# EasyEDA Pro project ProPrj_stm32电赛单片机开发板_2025-02-17.epro, board PCB1
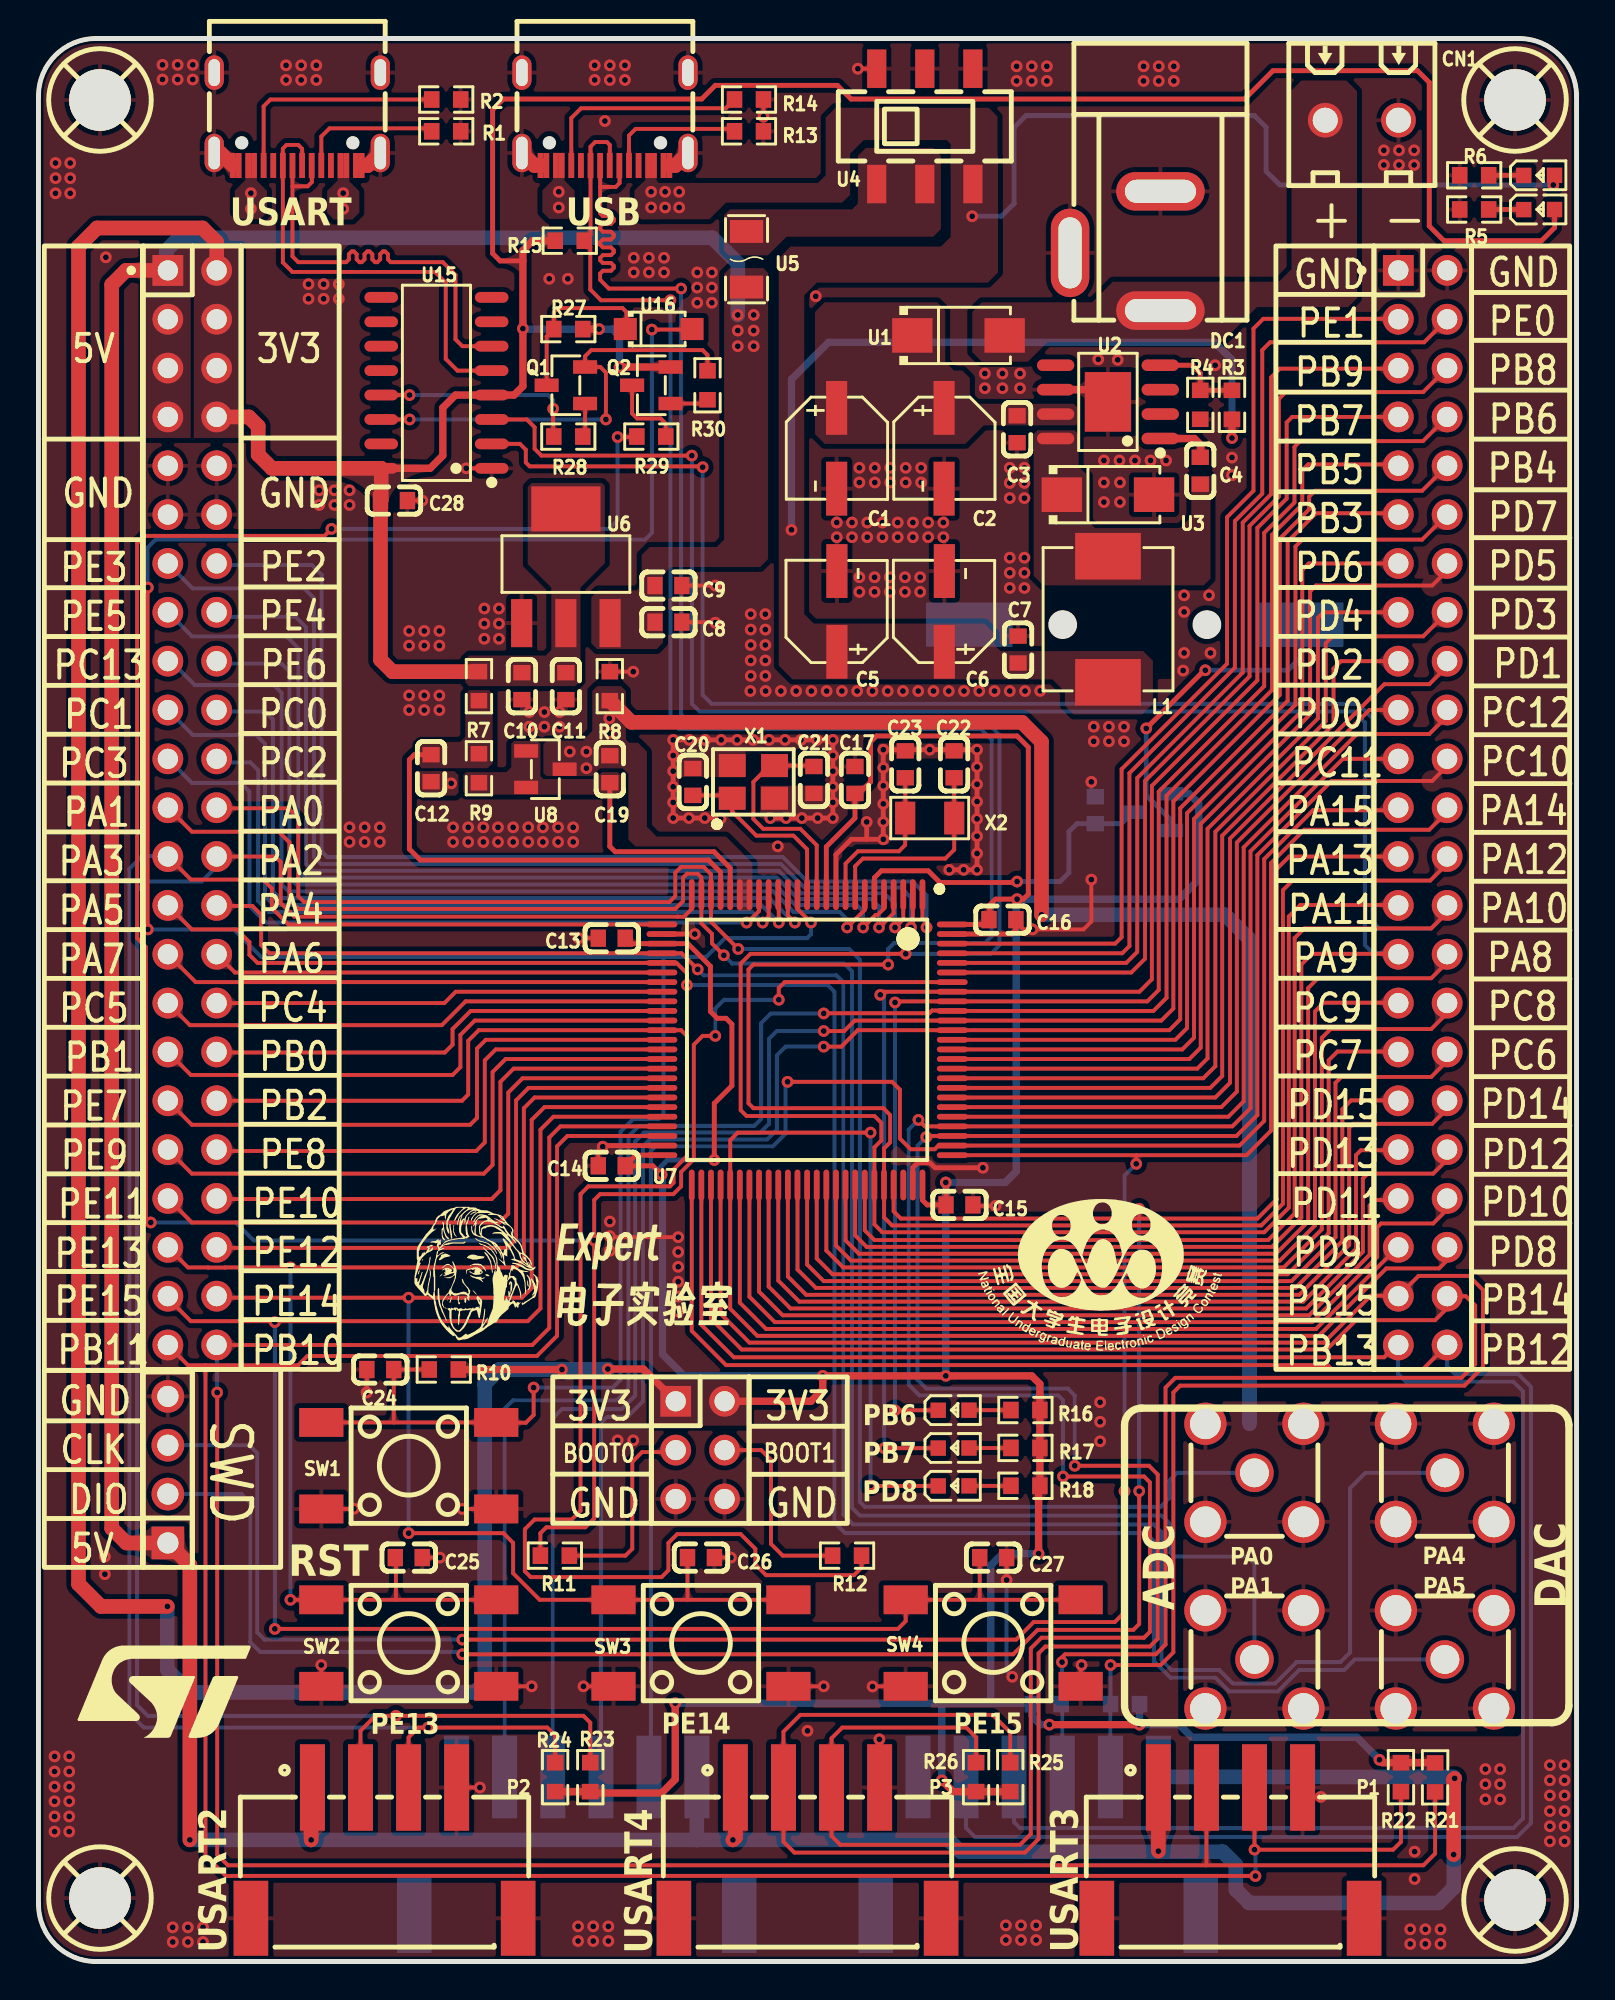
[diagram p3: board, top side]
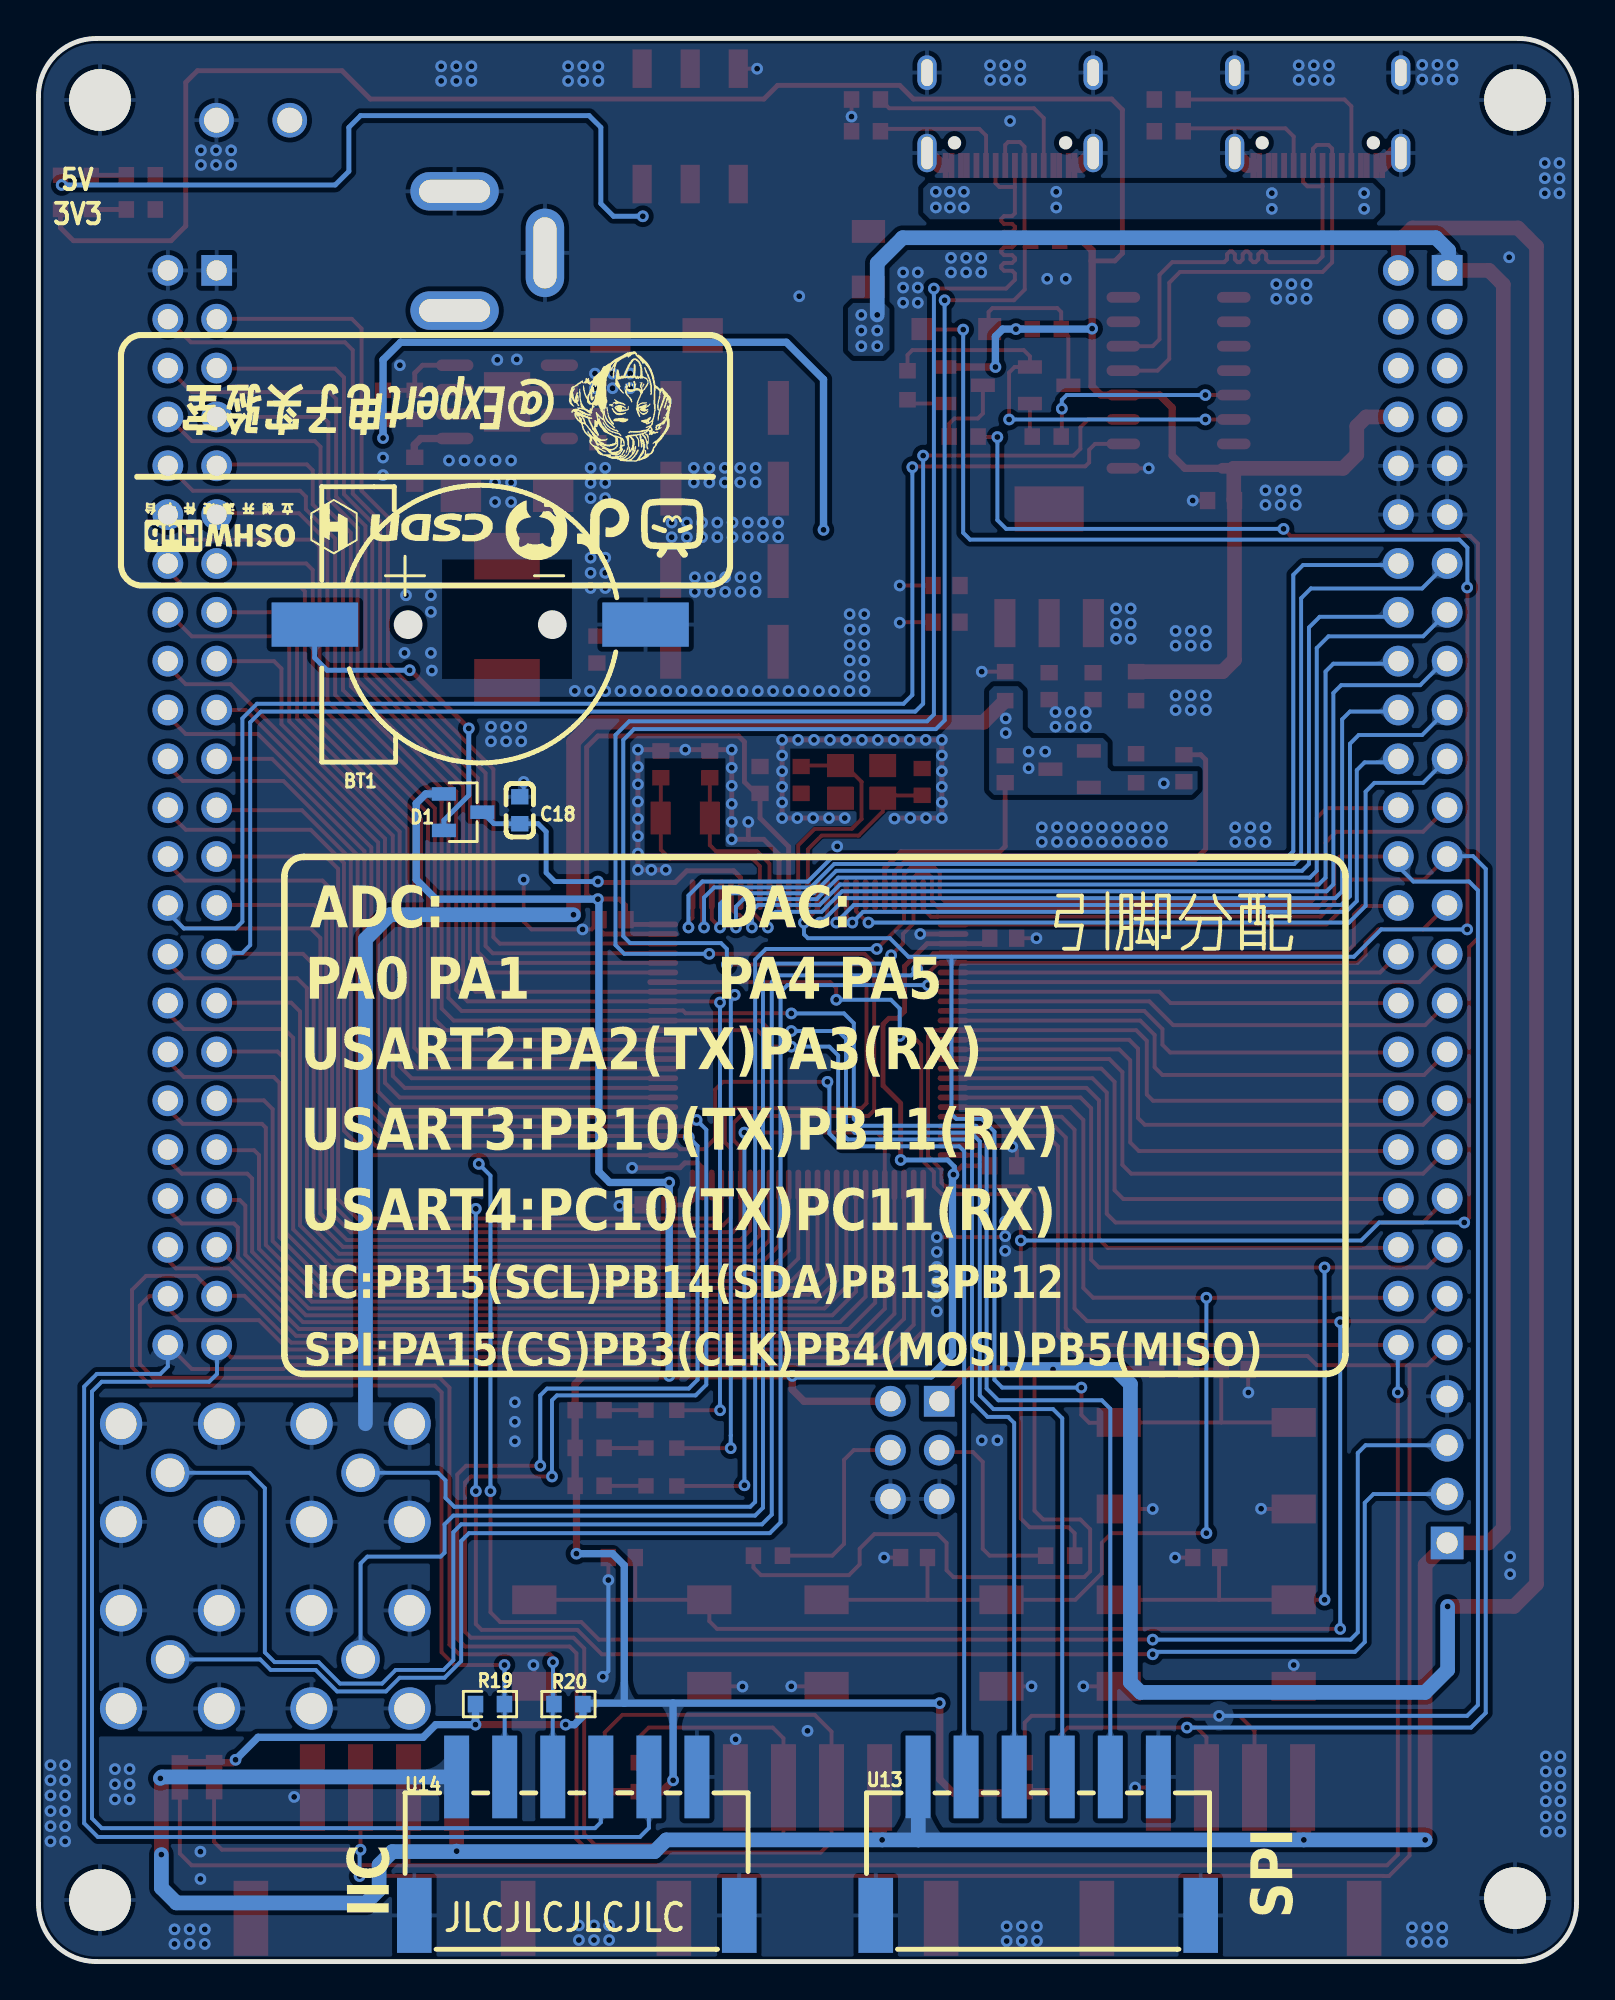
[diagram p4: board, bottom side, seen from below]

Outline 80 x 100 mm; copper layers: Top Layer, Bottom Layer. Coordinates in mm from the lower left corner of the outline.
Outline path: 0,97 0,3 arc(0.88,0.88) 3,0 77,0 arc(79.12,0.88) 80,3 80,97 arc(79.12,99.12) 77,100 3,100 arc(0.88,99.12) 0,97
Stack: Top Layer 0.035mm / Dielectric1 1.51mm FR4 er 4.5 / Bottom Layer 0.035mm

## Design rules (mm)
net PA12: DP2
net PA11: DP2
net DP: DP1
net DN: DP1
template: 自定义配置
spacing copperThickness1oz (default): track to track 0.102, other pairs 0.152 to 0.3
spacing copperThickness2oz: track to track 0.203, other pairs 0.152 to 0.3
track width copperThickness1oz (default): min 0.127, default 0.203, max 2.54
track width copperThickness2oz: min 0.203, default 0.254, max 2.54
differential pair differentialPair (default): width min 0.127, default 0.203, max 2.54; gap min 0.102, default 0.102
via viaSize (default): diameter min 0.5, default 0.61, max 10; hole min 0.3, default 0.305, max 6.299

## Placement (name value [footprint] x y rotation side)
BT1  CR1220-2ZX  [BAT-SMD_CR1220-2ZX]  57.02 69.52 180 bottom
C1  4.7uF  [CAP-SMD_BD5.0-L5.3-W5.3-FD]  41.52 78.69 270 top
C2  4.7uF  [CAP-SMD_BD5.0-L5.3-W5.3-FD]  47.1 78.69 270 top
C3  100nF  [C0603]  50.9 79.68 90 top
C4  10nF  [C0603]  60.43 77.52 270 top
C5  100uF  [CAP-SMD_BD5.0-L5.3-W5.3-FD]  41.53 70.21 90 top
C6  100uF  [CAP-SMD_BD5.0-L5.3-W5.3-FD]  47.12 70.21 90 top
C7  100nF  [C0603]  50.95 68.22 270 top
C8  10uF  [C0603]  32.77 69.65 180 top
C9  100nF  [C0603]  32.77 71.55 180 top
C10  10uF  [C0603]  25.15 66.32 90 top
C11  100nF  [C0603]  27.43 66.32 90 top
C12  100nF  [C0603]  20.42 62.05 90 top
C13  100nF  [C0603]  29.82 53.21 0 top
C14  100nF  [C0603]  29.82 41.38 0 top
C15  100nF  [C0603]  47.9 39.34 180 top
C16  100nF  [C0603]  50.14 54.18 180 top
C17  100nF  [C0603]  42.47 61.44 270 top
C18  100nF  [C0603]  54.97 59.87 90 bottom
C19  10uF  [C0603]  29.72 62 270 top
C20  20pF  [C0603]  34.04 61.34 90 top
C21  20pF  [C0603]  40.34 61.44 90 top
C22  10pF  [C0603]  47.62 62.26 270 top
C23  10pF  [C0603]  45.09 62.26 270 top
C24  100nF  [C0603]  17.78 30.78 0 top
C25  100nF  [C0603]  19.26 21.01 180 top
C26  100nF  [C0603]  34.46 21.01 180 top
C27  100nF  [C0603]  49.66 21.01 180 top
C28  100nF  [C0603]  18.49 75.97 0 top
CN1  MX128L-3.81-02P-GN01-Cu-Y-A  [CONN-TH_2P-P3.81_MX128L-3.81-GN01-02P-CU-Y-A]  68.83 95.75 180 top
D1  BAT54C  [SOT-23-3_L2.9-W1.3-P1.90-LS2.4-BR]  57.91 59.77 0 bottom
DC1  -  [DC-005_2.5]  58.04 89.08 90 top
H1  -  [HDR-TH_6P-P2.54-V-R2-C3-S2.54_A2541WV-2X3P]  34.42 26.59 270 top
H2  X6521WV-2x23H-C60D30  [HDR-TH_46P-2.54-V-M-R2-C23-S2.54]  8 60 270 top
H3  X6521WV-2x23H-C60D30  [HDR-TH_46P-2.54-V-M-R2-C23-S2.54]  72 60 270 top
H4  -  [HDR-TH_4P-P2.54-V-M]  6.73 25.58 90 top
L1  15uH  [IND-SMD_L7.3-W6.6]  55.63 69.8 90 top
LED1  -  [LED_0603]  78.1 91.11 0 top
LED2  -  [LED_0603]  78.1 92.89 0 top
LED3  -  [LED_0603]  47.65 28.68 0 top
LED4  -  [LED_0603]  47.65 26.71 0 top
LED5  -  [LED_0603]  47.65 24.74 0 top
P1  -  [CONN-SMD_XH2.54-4PSMD]  62 5.65 0 top
P2  -  [CONN-SMD_XH2.54-4PSMD]  18 5.65 0 top
P3  -  [CONN-SMD_XH2.54-4PSMD]  40 5.65 0 top
Q1  S8050  [SOT-23-3_L2.9-W1.3-P1.90-LS2.4-BR]  27.43 81.97 0 top
Q2  S8550  [SOT-23-3_L2.9-W1.3-P1.90-LS2.4-BR]  31.88 81.97 0 top
R1  5.1K  [R0603]  21.21 95.17 0 top
R2  5.1K  [R0603]  21.21 96.83 0 top
R3  10K  [R0603]  62.08 80.95 270 top
R4  3.16K  [R0603]  60.43 80.95 270 top
R5  2K  [R0603]  74.68 91.11 0 top
R6  5K  [R0603]  74.68 92.89 0 top
R7  0  [R0603]  22.91 66.32 270 top
R8  0  [R0603]  29.72 66.32 270 top
R9  1K  [R0603]  22.91 62.05 270 top
R10  10K  [R0603]  21.08 30.78 0 top
R11  10K  [R0603]  26.86 21.11 0 top
R12  10K  [R0603]  42.06 21.11 0 top
R13  5.1K  [R0603]  36.96 95.17 0 top
R14  5.1K  [R0603]  36.96 96.83 0 top
R15  10K  [R0603]  27.63 89.48 180 top
R16  2K  [R0603]  51.33 28.68 180 top
R17  2K  [R0603]  51.33 26.71 180 top
R18  2K  [R0603]  51.33 24.74 180 top
R19  4.7K  [R0603]  56.51 13.39 0 bottom
R20  4.7K  [R0603]  52.43 13.39 180 bottom
R21  4.7K  [R0603]  72.64 9.58 90 top
R22  4.7K  [R0603]  70.87 9.59 90 top
R23  4.7K  [R0603]  28.7 9.59 270 top
R24  4.7K  [R0603]  26.87 9.59 270 top
R25  4.7K  [R0603]  50.55 9.59 270 top
R26  4.7K  [R0603]  48.77 9.59 270 top
R27  10K  [R0603]  27.56 84.89 0 top
R28  1K  [R0603]  27.56 79.3 0 top
R29  1K  [R0603]  31.88 79.3 0 top
R30  1K  [R0603]  34.8 81.97 270 top
SCREW1  -  [M3螺丝]  3.2 96.8 0 top
SCREW2  -  [M3螺丝]  76.8 96.8 0 top
SCREW3  -  [M3螺丝]  3.2 3.3 0 top
SCREW4  -  [M3螺丝]  76.8 3.2 0 top
SW1  -  [SW-SMD_4P-L6.0-W6.0-P4.50-LS9.0-2]  19.26 25.78 0 top
SW2  -  [SW-SMD_4P-L6.0-W6.0-P4.50-LS9.0-2]  19.26 16.56 0 top
SW3  -  [SW-SMD_4P-L6.0-W6.0-P4.50-LS9.0-2]  34.46 16.56 0 top
SW4  -  [SW-SMD_4P-L6.0-W6.0-P4.50-LS9.0-2]  49.66 16.56 0 top
U1  SS54  [SMA_L4.2-W2.6-LS5.1-RD]  47.85 84.56 0 top
U2  TPS5450QDDARQ1  [SOIC-8_L4.9-W3.9-P1.27-LS6.0-BL-EP]  55.63 81.1 90 top
U3  SS54  [SMA_L4.2-W2.6-LS5.1-RD]  55.63 76.28 0 top
U4  YSSP2AG00  [SW-SMD_YSSP2AG00]  46.1 95.43 0 top
U5  JK-nSMD005/60V  [F1206]  36.83 88.52 270 top
U6  AMS1117-3.3  [SOT-223-3_L6.5-W3.4-P2.30-LS7.0-BR]  27.43 72.57 270 top
U7  STM32F103VET6  [LQFP-100_L14.0-W14.0-P0.50-LS16.0-BL]  39.98 47.93 180 top
U8  TL431  [SOT-23-3_L2.9-W1.3-P1.90-LS2.4-BR]  26.37 62 180 top
U9  HL-SMA-KE-02  [SMA-TH_HL-SMA-KHD2]  63.25 25.41 0 top
U10  HL-SMA-KE-02  [SMA-TH_HL-SMA-KHD2]  63.25 15.71 0 top
U11  HL-SMA-KE-02  [SMA-TH_HL-SMA-KHD2]  73.15 25.41 0 top
U12  HL-SMA-KE-02  [SMA-TH_HL-SMA-KHD2]  73.15 15.71 0 top
U13  XH2.54mm-LI-6P  [CONN-SMD_6P-P2.50-H]  28 6 180 bottom
U14  XH2.54mm-LI-6P  [CONN-SMD_6P-P2.50-H]  52 6 180 bottom
U15  CH340C  [SOP-16_L10.0-W3.9-P1.27-LS6.0-BL]  20.7 82.09 90 top
U16  1N4007W  [SOD-123FL_L2.7-W1.8-LS3.7-RD]  32.26 84.89 0 top
USB1  HC-TYPE-C-16P-01B  [USB-C-SMD_KH-TYPE-C-16P]  13.46 95.81 180 top
USB2  HC-TYPE-C-16P-01B  [USB-C-SMD_KH-TYPE-C-16P]  29.46 95.81 180 top
X1  8MHz  [CRYSTAL-SMD_4P-L3.2-W2.5-BL_SIT8008BI]  37.19 61.34 0 top
X2  32.768kHz  [OSC-SMD_L3.2-W1.5]  46.35 59.46 0 top

## Footprints (pads in the part's own frame, mm; a bottom-side part is the same pattern mirrored in y, then rotated)
BAT-SMD_CR1220-2ZX
  rect 4.5x2.3 smd: 1(-8.6,0) 2(8.6,0)
C0603
  rect 0.8x0.9 smd: 1(-0.7,0) 2(0.7,0)
CAP-SMD_BD5.0-L5.3-W5.3-FD
  rect 2.8x1.1 smd: 1(-2.1,0) 2(2.1,0)
CONN-SMD_6P-P2.50-H
  rect 1.3x4.3 smd: 1(-6.25,3.6) 2(-3.751,3.6) 3(-1.25,3.6) 4(1.25,3.6) 5(3.75,3.6) 6(6.25,3.6)
  rect 1.8x3.9 smd: 7(-8.45,-3.6) 8(8.45,-3.6)
CONN-SMD_XH2.54-4PSMD
  rect 1.3x4.5 smd: 1(-3.75,3.4) 2(-1.25,3.4) 3(1.25,3.4) 4(3.75,3.4)
  rect 1.8x3.9 smd: 5(-6.95,-3.4) 6(6.95,-3.4)
CONN-TH_2P-P3.81_MX128L-3.81-GN01-02P-CU-Y-A
  round 1.8 hole 1.3: 1(-1.905,0) 2(1.905,0)
CRYSTAL-SMD_4P-L3.2-W2.5-BL_SIT8008BI
  rect 1.4x1.2 smd: 1(-1.1,-0.85) 2(1.1,-0.85) 3(1.1,0.85) 4(-1.1,0.85)
DC-005_2.5
  oval 2x4.6 hole 1.2x3.7: 1(-3.227,-0.318) 2(2.973,-0.318)
  oval 4.6x2 hole 3.7x1.2: 3(-0.227,4.382)
F1206
  rect 1.19x1.728 smd: 1(-1.445,0) 2(1.445,0)
HDR-TH_4P-P2.54-V-M
  rect 1.7x1.7 hole 1.1: 1(-3.81,0)
  round 1.7 hole 1.1: 2(-1.27,0) 3(1.27,0) 4(3.81,0)
HDR-TH_6P-P2.54-V-R2-C3-S2.54_A2541WV-2X3P
  rect 1.6x1.6 hole 1.05: 1(-2.54,-1.27)
  round 1.6 hole 1.05: 2(-2.54,1.27) 3(0,-1.27) 4(0,1.27) 5(2.54,-1.27) 6(2.54,1.27)
HDR-TH_46P-2.54-V-M-R2-C23-S2.54
  rect 1.6x1.6 hole 1.05: 1(-27.94,-1.27)
  round 1.6 hole 1.05: 2(-27.94,1.27) 3(-25.4,-1.27) 4(-25.4,1.27) 5(-22.86,-1.27) 6(-22.86,1.27) 7(-20.32,-1.27) 8(-20.32,1.27) 9(-17.78,-1.27) 10(-17.78,1.27) 11(-15.24,-1.27) 12(-15.24,1.27) 13(-12.7,-1.27) 14(-12.7,1.27) 15(-10.16,-1.27) 16(-10.16,1.27) 17(-7.62,-1.27) 18(-7.62,1.27) 19(-5.08,-1.27) 20(-5.08,1.27) 21(-2.54,-1.27) 22(-2.54,1.27) 23(0,-1.27) 24(0,1.27) 25(2.54,-1.27) 26(2.54,1.27) 27(5.08,-1.27) 28(5.08,1.27) 29(7.62,-1.27) 30(7.62,1.27) 31(10.16,-1.27) 32(10.16,1.27) 33(12.7,-1.27) 34(12.7,1.27) 35(15.24,-1.27) 36(15.24,1.27) 37(17.78,-1.27) 38(17.78,1.27) 39(20.32,-1.27) 40(20.32,1.27) 41(22.86,-1.27) 42(22.86,1.27) 43(25.4,-1.27) 44(25.4,1.27) 45(27.94,-1.27) 46(27.94,1.27)
IND-SMD_L7.3-W6.6
  rect 2.424x3.42 smd: 1(3.278,0) 2(-3.278,0)
LED_0603
  rect 0.8x0.8 smd: 1(-0.851,-0.01) 2(0.75,-0.005)
LQFP-100_L14.0-W14.0-P0.50-LS16.0-BL
  oval 0.3x1.6 smd: 1(-6,-7.55) 2(-5.5,-7.55) 3(-5,-7.55) 4(-4.5,-7.55) 5(-4,-7.55) 6(-3.5,-7.55) 7(-3,-7.55) 8(-2.5,-7.55) 9(-2,-7.55) 10(-1.5,-7.55) 11(-1,-7.55) 12(-0.5,-7.55) 13(0,-7.55) 14(0.5,-7.55) 15(1,-7.55) 16(1.5,-7.55) 17(2,-7.55) 18(2.5,-7.55) 19(3,-7.55) 20(3.5,-7.55) 21(4,-7.55) 22(4.5,-7.55) 23(5,-7.55) 24(5.5,-7.55) 25(6,-7.55) 51(6,7.55) 52(5.5,7.55) 53(5,7.55) 54(4.5,7.55) 55(4,7.55) 56(3.5,7.55) 57(3,7.55) 58(2.5,7.55) 59(2,7.55) 60(1.5,7.55) 61(1,7.55) 62(0.5,7.55) 63(0,7.55) 64(-0.5,7.55) 65(-1,7.55) 66(-1.5,7.55) 67(-2,7.55) 68(-2.5,7.55) 69(-3,7.55) 70(-3.5,7.55) 71(-4,7.55) 72(-4.5,7.55) 73(-5,7.55) 74(-5.5,7.55) 75(-6,7.55)
  oval 1.6x0.3 smd: 26(7.55,-6) 27(7.55,-5.5) 28(7.55,-5) 29(7.55,-4.5) 30(7.55,-4) 31(7.55,-3.5) 32(7.55,-3) 33(7.55,-2.5) 34(7.55,-2) 35(7.55,-1.5) 36(7.55,-1) 37(7.55,-0.5) 38(7.55,0) 39(7.55,0.5) 40(7.55,1) 41(7.55,1.5) 42(7.55,2) 43(7.55,2.5) 44(7.55,3) 45(7.55,3.5) 46(7.55,4) 47(7.55,4.5) 48(7.55,5) 49(7.55,5.5) 50(7.55,6) 76(-7.55,6) 77(-7.55,5.5) 78(-7.55,5) 79(-7.55,4.5) 80(-7.55,4) 81(-7.55,3.5) 82(-7.55,3) 83(-7.55,2.5) 84(-7.55,2) 85(-7.55,1.5) 86(-7.55,1) 87(-7.55,0.5) 88(-7.55,0) 89(-7.55,-0.5) 90(-7.55,-1) 91(-7.55,-1.5) 92(-7.55,-2) 93(-7.55,-2.5) 94(-7.55,-3) 95(-7.55,-3.5) 96(-7.55,-4) 97(-7.55,-4.5) 98(-7.55,-5) 99(-7.55,-5.5) 100(-7.55,-6)
M3螺丝
  round 3.2 hole 3.2: 1(0,0)
OSC-SMD_L3.2-W1.5
  rect 1.05x1.7 smd: 1(-1.275,0) 2(1.275,0)
R0603
  rect 0.806x0.864 smd: 1(-0.753,0) 2(0.753,0)
SMA-TH_HL-SMA-KHD2
  round 2.2 hole 1.6: 1(-2.55,2.55) 2(2.55,2.55) 3(2.55,-2.55) 4(-2.55,-2.55)
  round 2 hole 1.5: 5(0,0)
SMA_L4.2-W2.6-LS5.1-RD
  rect 2.1x1.8 smd: 1(-2.4,0) 2(2.4,0)
SOD-123FL_L2.7-W1.8-LS3.7-RD
  rect 1.2x1.15 smd: 1(-1.735,0) 2(1.735,0)
SOIC-8_L4.9-W3.9-P1.27-LS6.0-BL-EP
  oval 0.602x1.941 smd: 1(-1.905,-2.72) 2(-0.635,-2.72) 3(0.635,-2.72) 4(1.905,-2.72) 5(1.905,2.72) 6(0.635,2.72) 7(-0.635,2.72) 8(-1.905,2.72)
  rect 3.098x2.41 smd: 9(0,0)
SOP-16_L10.0-W3.9-P1.27-LS6.0-BL
  oval 0.56x1.745 smd: 1(-4.445,-2.873) 2(-3.175,-2.873) 3(-1.905,-2.873) 4(-0.635,-2.873) 5(0.635,-2.873) 6(1.905,-2.873) 7(3.175,-2.873) 8(4.445,-2.873) 9(4.445,2.873) 10(3.175,2.873) 11(1.905,2.873) 12(0.635,2.873) 13(-0.635,2.873) 14(-1.905,2.873) 15(-3.175,2.873) 16(-4.445,2.873)
SOT-23-3_L2.9-W1.3-P1.90-LS2.4-BR
  rect 1.25x0.7 smd: 1(1,-0.95) 2(1,0.95) 3(-1,0)
SOT-223-3_L6.5-W3.4-P2.30-LS7.0-BR
  rect 2.5x1.1 smd: 1(2.97,-2.3) 2(2.97,0) 3(2.97,2.3)
  rect 2.34x3.6 smd: 4(-2.97,0)
SW-SMD_4P-L6.0-W6.0-P4.50-LS9.0-2
  rect 2.3x1.5 smd: 1(-4.55,2.25) 2(4.55,2.25) 3(-4.55,-2.25) 4(4.55,-2.25)
SW-SMD_YSSP2AG00
  rect 1x2 smd: 1(-2.5,3) 2(0,3) 3(2.5,3) 4(-2.5,-3) 5(0,-3) 6(2.5,-3)
USB-C-SMD_KH-TYPE-C-16P
  oval 1x2 hole 0.6x1.7: 1(-4.32,1.765) 2(4.32,1.765)
  oval 1x1.8 hole 0.6x1.4: 3(-4.32,-2.415) 4(4.32,-2.415)
  rect 0.3x1.3 smd: A1(-3.35,2.415) A4(-2.55,2.415) A5(-1.25,2.415) A6(-0.25,2.415) A7(0.25,2.415) A8(1.25,2.415) A9(2.55,2.415) A12(3.35,2.415) B1(3.05,2.415) B4(2.25,2.415) B5(1.75,2.415) B6(0.75,2.415) B7(-0.75,2.415) B8(-1.75,2.415) B9(-2.25,2.415) B12(-3.05,2.415)

## Nets
As in the schematic.

Pads without a net: U2 2 3 5; U7 73; U15 7 8 9 10 11 12 15; USB1 A8 B8; USB2 A8 B8

## Via types
v1: diameter 0.61, hole 0.305, Top Layer to Bottom Layer, 504 vias

## Routing (per net, layer and track width the routed paths; a pad name or vN(x,y) marks a point on that pad's centre or on a via; arc(x,y) is an arc through that point)
AGND: length 68.9
  Top Layer w0.762: R8.2 30.84,64.44 51.15,64.44 52.17,63.42 v1(52.17,54.43)
  Bottom Layer w0.762: 62.99,27.97 62.99,53.16 61.72,54.43 v1(52.17,54.43)
  vias: v1(21.47,61.27) v1(27.63,62.92) v1(28.5,62.92) v1(28.5,62.05) v1(29.69,64.64) v1(29.69,63.88)
GND: length 115.7
  Top Layer w0.203: 29.38,42.4 29.11,42.19 29.11,41.39 C14.1 ; v1(29.72,37.72) 29.77,37.67 v1(33.27,37.67) ; SW3.4 v1(40.84,14.31) ; U4.1 v1(42.62,98.43) ; R14.2 v1(37.71,95.94) ; C8.1 35.18,69.65 v1(35.2,69.62) ; SW4.3 43.39,14.31 v1(43.38,14.3) ; P1.4 66.24,8.56 v1(66.7,8.56) ; U15.1 v1(22.25,77.65) ; v1(54.76,56.26) 54.76,54.08 54.36,53.67 v1(51.7,53.67) 51.22,53.67 50.87,54.03 ; 19.96,21.01 v1(20.88,21.01) ; 48.6,39.29 v1(49.78,39.29) ; C26.1 v1(36.02,21.01) ; v1(54.25,15.42) 54.21,15.37 SW4.4 ; SW1.4 v1(22.05,23.53) ; v1(17.07,29.59) 17.08,29.6 C24.1 ; v1(16.41,23.55) 16.4,23.53 SW1.3 ; P3.4 43.75,11.55 v1(43.74,11.56) ; P2.4 v1(22.96,9.05) ; C27.1 v1(50.36,19.84) ; C28.2 v1(19.96,75.97) ; SW2.4 v1(25.65,14.31) ; C13.1 v1(28.09,53.21) ; C9.1 v1(35.2,71.55) ; 29.72,67.07 v1(30.94,67.07) ; SW2.3 v1(14.71,15.42) ; SW3.3 v1(28.35,14.31)
  Top Layer w0.254: 50.84,53.94 50.84,53.66 50.61,53.43 U7.99 ; 50.84,53.94 50.87,54.03 ; 50.84,53.94 C16.1 ; v1(49.12,41.28) 46.63,41.28 46.38,41.53 45.72,41.53 45.48,41.29 U7.74 ; v1(35.48,59.43) 35.45,59.46 v1(34.66,59.46) v1(33.84,59.46) v1(33.01,59.46) v1(33.01,60.27) v1(33.01,61.09) v1(33.01,61.9) v1(33.01,62.71) v1(33.01,63.53) v1(33.85,63.53) v1(34.68,63.53) v1(35.51,63.53) v1(36.34,63.53) v1(37.17,63.53) v1(38,63.53) v1(38.83,63.53) v1(39.66,63.53) v1(40.49,63.53) v1(41.32,63.53) v1(41.32,62.71) v1(41.32,61.9) v1(41.32,61.09) v1(41.32,60.27) v1(41.32,59.46) v1(40.53,59.46) v1(39.71,59.46) v1(38.88,59.46) v1(38.06,59.46) ; v1(43.08,59.26) 43.08,58.38 43.05,58.36 ; 43.05,58.36 v1(43.94,58.36) v1(43.94,59.26) v1(43.94,60.2) v1(43.94,61.14) v1(43.94,62.08) v1(43.94,63.02) v1(46.35,63.02) v1(48.82,63.02) v1(48.82,62.12) v1(48.82,61.22) v1(48.82,60.32) v1(48.82,59.42) v1(48.82,58.52) v1(48.82,57.62) v1(48.82,56.77) v1(48.12,56.77) v1(47.37,56.77) ; 43.05,58.36 42.28,58.36 41.48,57.56 U7.10 ; U7.49 29.41,42.43 29.38,42.4 v1(29.35,42.37) ; U7.27 v1(34.14,53.43)
  Top Layer w0.381: U2.6 54.99,81.74 55.13,81.6
  Top Layer w0.762: USB2.A1 33.13,93.39 USB2.1 ; USB1.2 9.46,94.04 USB1.A12 ; USB1.1 17.13,93.39 USB1.A1 ; USB2.2 25.79,93.39 USB2.A12
  Bottom Layer w0.203: v1(50.65,14.81) 50.36,15.1 v1(50.36,19.84) ; v1(54.76,61.34) 54.76,60.77 C18.2
  vias: v1(0.84,10.67) v1(0.84,9.88) v1(0.84,9.09) v1(0.84,8.33) v1(0.84,7.54) v1(0.84,6.76) v1(0.89,93.52) v1(0.89,92.74) v1(0.89,91.95) v1(1.6,10.67) v1(1.6,9.88) v1(1.6,9.09) v1(1.6,8.33) v1(1.6,7.54) v1(1.6,6.76) v1(1.65,93.52) v1(1.65,92.74) v1(1.65,91.95) v1(3.5,88.62) v1(3.45,21.06) v1(3.45,20.14) v1(6.45,98.63) v1(6.45,97.87) v1(6.98,1.78) v1(6.98,1.02) v1(7.24,98.63) v1(7.24,97.87) v1(7.77,1.78) v1(7.77,1.02) v1(8.03,98.63) v1(8.03,97.87) v1(8.56,1.78) v1(8.56,1.02) v1(12.88,98.6) v1(12.88,97.84) v1(13.67,98.6) v1(13.67,97.84) v1(14.05,87.22) v1(14.05,86.46) v1(14.45,98.6) v1(14.45,97.84) v1(14.61,76.5) v1(14.61,75.74) v1(14.83,87.22) v1(14.83,86.46) v1(15.39,76.5) v1(15.39,75.74) v1(15.62,87.22) v1(15.62,86.46) v1(16.18,76.5) v1(16.18,75.74) v1(16.18,58.98) v1(16.18,58.22) v1(16.97,58.98) v1(16.97,58.22) v1(17.75,58.98) v1(17.75,58.22) v1(19.28,69.19) v1(19.28,68.43) v1(19.28,65.84) v1(19.28,65.08) v1(20.07,69.19) v1(20.07,68.43) v1(20.07,65.84) v1(20.07,65.08) v1(20.85,69.19) v1(20.85,68.43) v1(20.85,65.84) v1(20.85,65.08) v1(21.56,58.98) v1(21.56,58.22) v1(22.35,58.98) v1(22.35,58.22) v1(23.14,58.98) v1(23.14,58.22) v1(23.19,70.36) v1(23.19,69.57) v1(23.19,68.78) v1(23.9,58.98) v1(23.9,58.22) v1(23.95,70.36) v1(23.95,69.57) v1(23.95,68.78) v1(24.69,58.98) v1(24.69,58.22) v1(25.53,64.97) v1(25.53,64.21) v1(25.48,58.98) v1(25.48,58.22) v1(26.24,58.98) v1(26.24,58.22) v1(26.31,64.97) v1(26.31,64.21) v1(26.57,87.5) v1(27.03,58.98) v1(27.03,58.22) v1(27.1,64.97) v1(27.1,64.21) v1(27.53,87.5) v1(27.81,58.98) v1(27.81,58.22) v1(28.07,1.83) v1(28.07,1.07) v1(28.93,98.6) v1(28.93,97.84) v1(28.85,1.83) v1(28.85,1.07) v1(29.46,95.71) v1(29.64,1.83) v1(29.64,1.07) v1(29.72,98.6) v1(29.72,97.84) v1(29.72,38.48) v1(29.72,36.96) v1(30.12,27.1) v1(30.51,98.6) v1(30.51,97.84) v1(30.94,27.1) v1(30.96,88.6) v1(30.96,87.83) v1(31.75,88.6) v1(31.75,87.83) v1(32.54,88.6) v1(32.54,87.83) v1(33.27,36.9) v1(33.27,36.12) v1(33.27,35.35) v1(33.27,34.58) v1(33.27,33.81) v1(34.26,87.83) v1(34.26,87.05) v1(34.26,86.26) v1(35.03,87.83) v1(35.03,87.05) v1(35.03,86.26) v1(37.05,70.07) v1(37.05,69.26) v1(37.05,68.46) v1(37.05,67.66) v1(37.05,66.85) v1(37.03,66.07) v1(37.81,70.07) v1(37.81,69.26) v1(37.81,68.46) v1(37.81,67.66) v1(37.81,66.85) v1(37.82,66.07) v1(38.46,57.99) v1(38.61,66.07) v1(39.41,66.07) v1(40,12) v1(40.2,66.07) v1(40.43,86.6) v1(41,66.07) v1(41.52,74.83) v1(41.52,74.07) v1(41.79,66.07) v1(42.31,74.83) v1(42.31,74.07) v1(42.58,66.07) v1(42.7,77.67) v1(42.7,76.91) v1(42.7,71.98) v1(42.7,71.22) v1(43.11,74.83) v1(43.11,74.07) v1(43.38,66.07) v1(43.5,77.67) v1(43.5,76.91) v1(43.49,71.98) v1(43.49,71.22) v1(43.9,74.83) v1(43.9,74.07) v1(44.17,66.07) v1(44.3,77.67) v1(44.3,76.91) v1(44.28,71.98) v1(44.28,71.22) v1(44.69,74.83) v1(44.69,74.07) v1(44.96,66.07) v1(45.11,77.67) v1(45.11,76.91) v1(45.07,71.98) v1(45.07,71.22) v1(45.48,74.83) v1(45.48,74.07) v1(45.76,66.07) v1(45.91,77.67) v1(45.91,76.91) v1(45.86,71.98) v1(45.86,71.22) v1(46.27,74.83) v1(46.27,74.07) v1(46.55,66.07) v1(47.07,74.83) v1(47.07,74.07) v1(47.35,66.07) v1(48.14,66.07) v1(48.93,66.07) v1(49.22,82.58) v1(49.22,81.81) v1(49.73,66.07) v1(50.14,82.58) v1(50.14,81.81) v1(50.32,1.88) v1(50.32,1.12) v1(50.52,77.67) v1(50.52,76.89) v1(50.52,76.1) v1(50.52,73) v1(50.52,72.21) v1(50.52,71.42) v1(50.52,66.07) v1(50.88,98.55) v1(50.88,97.79) v1(51.05,82.58) v1(51.05,81.81) v1(51.1,1.88) v1(51.1,1.12) v1(51.28,77.67) v1(51.28,76.89) v1(51.28,76.1) v1(51.28,73) v1(51.28,72.21) v1(51.28,71.42) v1(51.31,66.07) v1(51.66,98.55) v1(51.66,97.79) v1(51.89,1.88) v1(51.89,1.12) v1(52.1,66.07) v1(52.45,98.55) v1(52.45,97.79) v1(54.89,64.21) v1(54.89,63.45) v1(55.12,83.31) v1(55.22,29.08) v1(55.22,28.07) v1(55.22,27.05) v1(55.42,78.05) v1(55.42,76.91) v1(55.42,75.89) v1(55.68,64.21) v1(55.68,63.45) v1(56.13,83.29) v1(56.23,78.05) v1(56.25,76.91) v1(56.25,75.9) v1(56.46,64.21) v1(56.46,63.45) v1(57.03,78.05) v1(57.48,98.55) v1(57.48,97.79) v1(57.84,78.05) v1(58.27,98.55) v1(58.27,97.79) v1(58.65,78.05) v1(59.06,98.55) v1(59.06,97.79) v1(59.54,67.13) v1(59.59,71.04) v1(59.59,70.18) v1(59.59,68.05) v1(60.88,71.04) v1(60.96,68.05) v1(61.2,83.01) v1(62.08,78.21) v1(62.08,77.29) v1(69.98,94.18) v1(69.98,93.42) v1(70.76,94.18) v1(70.76,93.42) v1(71.35,1.68) v1(71.35,0.91) v1(71.55,94.18) v1(71.55,93.42) v1(71.58,5.72) v1(71.58,4.29) v1(72.14,1.68) v1(72.14,0.91) v1(72.92,1.68) v1(72.92,0.91) v1(75.26,10.01) v1(75.26,9.22) v1(75.26,8.43) v1(76.02,10.01) v1(76.02,9.22) v1(76.02,8.43) v1(78.61,10.21) v1(78.61,9.42) v1(78.61,8.64) v1(78.61,7.82) v1(78.61,7.04) v1(78.61,6.25) v1(79.38,10.21) v1(79.38,9.42) v1(79.38,8.64) v1(79.38,7.82) v1(79.38,7.04) v1(79.38,6.25)
VCC+3.3V: length 483.4
  Top Layer w0.254: LED1.2 78.85,90.16 78.18,89.48 73.1,89.48 72.34,90.25 72.34,97.71 71.73,98.32 64.21,98.32 62.74,96.85 42.27,96.85 41.55,97.56 35.2,97.56 34.49,96.85 24.18,96.85 23.62,96.29 23.62,88.82 24.01,88.43 25.2,88.43 ; C13.2 30.8,52.93 U7.28 33.78,52.93 34.95,51.76 34.95,49.4 35.31,49.05 35.76,49.05 36.07,48.74 36.07,45.54 35.15,44.63 v1(35.15,41.68) ; v1(47.19,40.51) 47.2,40.5 C15.2 46.23,39.34 45.98,39.59 U7.75 ; U7.100 49.37,53.93 49.47,54.03 49.47,54.93 49.78,55.25 v1(50.9,55.25) 51.23,55.25 51.49,55.5 51.49,63.14 50.9,63.73 43.59,63.73 43.28,63.42 43.28,61.34 42.68,60.74 C17.2 42.47,59.46 40.98,57.97 U7.11 ; v1(32.41,40.92) 31.95,41.38 C14.2 31.07,41.93 U7.50
  Top Layer w0.381: v1(29.62,30.81) 31.47,30.81 H1.1 ; v1(57.27,12.32) v1(52.58,12.32) ; R21.2 72.63,10.34 R22.2 69.9,10.34 v1(69.75,10.49) ; v1(33.12,13.44) 33.12,9.47 32.41,8.76 28.77,8.76 R23.2 R24.2 ; R25.2 R26.2 47.58,8.83 v1(46.99,9.42) ; v1(52.02,21.21) 52.02,24.67 R18.1 R17.1 R16.1 52.09,30.03 51.66,30.46 v1(47.19,30.46) v1(40.79,30.46) 40.79,29.74 40.18,29.13 H1.2 ; R15.2 25.71,89.48 25.2,88.98 v1(25.2,84.91) 25.2,81.92 24.74,81.46 U15.4 21.69,81.46 21.03,80.8 21.03,78.31 20.37,77.65 U15.16 ; R27.2 v1(29.16,84.89) ; Q2.2 v1(30.23,82.92) ; R10.2 v1(27.23,30.78)
  Top Layer w0.762: v1(6.71,18.47) 3.25,18.47 2.08,19.63 2.08,89.18 3.05,90.14 8.53,90.14 9.27,89.41 H2.2 ; 22.91,67.07 18.41,67.07 17.79,67.69 C28.1 17.83,76.01 U15.16 12.14,77.65 11.43,78.36 11.43,79.83 10.94,80.32 H2.8
  Bottom Layer w0.254: v1(32.41,40.92) 32.36,40.97 32.36,41.33 32.72,41.68 v1(35.15,41.68)
  Bottom Layer w0.381: v1(25.2,84.91) 25.22,84.89 v1(29.16,84.89) 29.84,84.89 30.23,84.51 v1(30.23,82.92) ; v1(52.02,21.21) 50.14,21.21 49.53,20.6 49.53,13.44 ; D1.1 59.86,60.72 60.35,60.22 60.35,56.26 59.33,55.25 v1(50.9,55.25) 50.85,55.19 50.85,41.07 50.29,40.51 v1(47.19,40.51) v1(47.19,30.46) ; R19.2 v1(57.27,12.32) 59.33,12.32 60,11.66 68.58,11.66 v1(69.75,10.49) ; 46.99,13.44 v1(33.12,13.44) ; 46.99,13.44 49.53,13.44 ; 46.99,13.44 v1(46.99,9.42) ; 49.53,13.44 51.63,13.44 R20.2 51.68,12.76 52.12,12.32 v1(52.58,12.32) ; v1(32.41,40.92) 32.46,40.87 32.46,31.57 33.58,30.46 v1(40.79,30.46)
  Bottom Layer w0.762: v1(6.71,18.47) 6.71,15.16 7.87,14 22.68,14 23.21,14.52 23.21,30.03 23.96,30.78 v1(27.23,30.78) 29.59,30.78 v1(29.62,30.81)
VCC+5V: length 222.8
  Top Layer w0.762: v1(73.61,5.56) 73.61,9.47 v1(73.66,9.53) ; v1(7.87,6.32) 7.87,20.62 H4.1 4.57,21.77 3.81,22.53 3.81,87.2 4.55,87.94 H2.1 ; P1.1 v1(58.25,5.74) ; P2.1 14.18,8.98 v1(14.18,6.32) ; P3.1 36.25,6.46 v1(36.12,6.32)
  Bottom Layer w0.762: 34.24,6.32 v1(14.18,6.32) v1(7.87,6.32) ; 34.24,6.32 34.24,9.59 U13.1 ; 34.24,6.32 v1(36.12,6.32) 47.35,6.32 47.96,5.72 58.26,5.72 ; H2.1 6.66,88.02 6.66,88.98 7.31,89.64 35.05,89.64 36.37,88.32 v1(36.37,85.62) ; U14.1 73.59,9.6 v1(73.66,9.53) ; v1(73.61,5.56) 73.61,3.84 72.82,3.05 62.97,3.05 62.28,3.73 62.28,5.03 61.59,5.72 58.26,5.72 ; 58.26,5.72 58.25,5.72 v1(58.25,5.74)
  vias: v1(36.37,84.81) v1(36.37,84) v1(37.2,85.62) v1(37.2,84.81) v1(37.2,84)
VCCA+3.3V: length 23.7
  Top Layer w0.254: U7.22 35.48,56.65 34.85,57.28 19.86,57.28 19.29,57.85 19.29,62.5 19.55,62.75 C12.2
BOOT0: length 139.2
  Top Layer w0.203: v1(5.84,38.43) 5.59,38.68 5.59,52.76 5.13,53.21 5.13,73.74 5.53,74.13 14.88,74.13 v1(15.24,74.5) ; v1(30.12,79.27) 31.1,79.27 R29.1 ; v1(38.51,50.01) 38.51,50.62 38.81,50.93 U7.94 ; R11.1 26.11,22.27 26.42,22.58 28.45,22.58 28.91,23.04 v1(28.91,37.5) 28.91,39.6 29.21,39.9 33.02,39.9 33.43,40.31 33.43,41.06 34.09,41.72 34.09,47.68 34.54,48.13 v1(35.2,48.13)
  Bottom Layer w0.203: v1(28.91,37.5) 11.2,37.5 10.26,38.43 v1(5.84,38.43) ; v1(15.24,74.5) 29.67,74.5 30.12,74.96 v1(30.12,79.27) ; v1(35.2,48.13) 35.2,49.56 35.66,50.01 v1(38.51,50.01)
BOOT1: length 84.2
  Top Layer w0.203: H2.36 22.03,44.76 22.35,45.08 22.35,47.88 22.9,48.43 U7.37 33.43,48.43 33.73,48.12 33.73,41.89 33.03,41.19 33.03,40.5 32.84,40.31 28.6,40.31 28.19,39.9 28.19,23.44 27.74,22.99 25.81,22.99 25.3,22.48 25.3,20.29 25.6,19.99 32.41,19.99 32.77,20.35 32.77,21.77 33.22,22.22 36.53,22.22 37.29,21.46 37.29,20.65 37.85,20.09 42.42,20.09 42.81,20.49 R12.2
CC11: length 7.2
  Top Layer w0.203: R13.1 36.08,95.3 31.06,95.3 30.71,94.95 USB2.A5
CC12: length 11.4
  Top Layer w0.203: R14.1 35.75,96.37 28.22,96.37 27.71,95.86 USB2.B5
CC21: length 7.5
  Top Layer w0.203: USB1.A5 14.71,94.9 15.14,95.33 20.3,95.33 R1.1
CC22: length 12
  Top Layer w0.203: USB1.B5 11.71,96.47 12.06,96.83 R2.1
DN: length 23.3
  Top Layer w0.203: USB1.A7 13.21,92.31 ; 13.21,92.31 14,92.31 14.22,92.53 14.22,93.38 USB1.B7 ; 13.21,92.31 13.21,88.67 13.51,88.37 16,88.37 16.15,88.51 16.15,88.78 16.29,88.93 16.41,88.93 16.55,88.78 16.55,88.51 16.7,88.37 16.82,88.37 16.96,88.51 16.96,88.78 17.1,88.93 17.22,88.93 17.37,88.78 17.37,88.51 17.51,88.37 17.63,88.37 17.77,88.51 17.77,88.78 17.92,88.93 18.03,88.93 18.18,88.78 18.18,88.51 18.32,88.37 21.03,88.37 21.69,87.71 21.69,84.35 22.05,84 U15.6
DP: length 23.5
  Top Layer w0.203: USB1.A6 13.71,94.26 13.51,94.46 12.9,94.46 12.71,94.27 USB1.B6 12.71,88.36 13.21,87.86 20.62,87.86 21.18,87.3 21.18,83.34 21.79,82.73 U15.5
DTR: length 11
  Top Layer w0.203: v1(26.77,80.75) 26.77,79.33 R28.1 ; U15.13 v1(19.3,81.46)
  Bottom Layer w0.203: v1(19.3,81.46) 26.52,81.46 26.77,81.2 v1(26.77,80.75)
FB: length 4.8
  Top Layer w0.254: U2.4 60.02,83.01 60.43,82.6 R4.1 R3.1
OSCH1: length 12.2
  Top Layer w0.203: 40.59,62.04 40.44,62.19 38.04,62.19 37.19,61.34 37.19,59.41 37.69,58.9 39.62,58.9 40.48,58.05 U7.12
OSCH2: length 10.1
  Top Layer w0.203: 33.78,60.64 35.94,60.64 X1.1 36.09,59.8 37.34,58.55 39.27,58.55 39.98,57.84 U7.13
OSCL1: length 10.7
  Top Layer w0.203: C22.2 47.63,61.55 X2.2 47.63,57.82 47.17,57.35 42.88,57.35 42.48,56.96 U7.8
OSCL2: length 8.6
  Top Layer w0.203: C23.2 45.09,59.47 X2.1 45.08,58.06 44.75,57.73 42.62,57.73 41.98,57.09 U7.9
PA0: length 92.9
  Top Layer w0.203: H2.24 9.3,59.97 13,59.97 13.51,59.46 13.51,55.4 13.82,55.09 32.82,55.09 33.12,55.4 33.12,56.62 33.43,56.92 34.59,56.92 34.98,56.54 U7.23 34.98,54.07 v1(36.4,52.65)
  Bottom Layer w0.203: U9.5 59.22,25.41 58.83,25.02 58.83,24.1 58.37,23.65 42.98,23.65 42.72,23.9 42.72,52.1 42.16,52.65 v1(36.4,52.65)
PA1: length 100.7
  Top Layer w0.203: H2.23 7.98,58.75 12.5,58.75 13.06,58.19 13.06,55.19 13.51,54.74 33.12,54.74 33.53,55.14 33.53,56.36 33.73,56.57 34.29,56.57 34.48,56.38 U7.24 34.48,53.99 35.03,53.44 35.03,52.94 v1(35.65,52.33)
  Bottom Layer w0.203: U10.5 63.25,20.7 62.89,21.06 59.08,21.06 58.88,21.26 58.88,22.73 58.42,23.19 42.72,23.19 42.32,23.6 42.32,51.49 41.91,51.89 36.08,51.89 v1(35.65,52.33)
PA2: length 106.8
  Top Layer w0.203: U7.25 33.98,54.73 33.58,54.33 33.25,54.33 33.25,54.33 13.31,54.33 12.6,55.04 12.6,57.18 12.31,57.46 H2.26 ; R23.1 28.7,12.42 28.35,12.78 v1(18.59,12.78) 17.53,12.78 16.75,12 P2.2
  Bottom Layer w0.203: v1(18.59,12.78) 5.69,12.78 5.13,13.34 5.13,55.7 5.59,56.16 8.48,56.16 9.27,56.95 H2.26
PA3: length 101.8
  Top Layer w0.203: U7.26 13,53.93 12.14,54.79 12.14,55.8 11.68,56.26 7.93,56.26 H2.25 ; P2.3 19.25,11.66 19.76,12.17 v1(20.26,12.17) 26.47,12.17 26.87,11.76 R24.1
  Bottom Layer w0.203: v1(20.26,12.17) 5.49,12.17 4.72,12.93 4.72,56.82 5.39,57.48 6.71,57.48 H2.25
PA4: length 111.2
  Top Layer w0.203: v1(34.29,51.59) 33.45,52.43 U7.29 12.01,52.43 11.58,52.86 11.58,54.43 11.12,54.89 9.3,54.89 H2.28
  Bottom Layer w0.203: U11.5 69.03,25.41 68.22,24.61 68.22,16.08 67.72,15.57 65.43,15.57 64.32,14.46 62.13,14.46 61.42,15.16 58.93,15.16 58.42,15.67 58.42,22.33 58.01,22.73 42.37,22.73 41.86,23.24 41.86,50.93 41.5,51.28 34.6,51.28 v1(34.29,51.59)
PA5: length 104.6
  Top Layer w0.203: v1(33.73,50.78) 33.73,51.38 33.19,51.93 U7.30 11.39,51.93 10.97,52.35 10.97,53.01 10.31,53.67 7.98,53.67 H2.27
  Bottom Layer w0.203: v1(33.73,50.78) 41.05,50.78 41.4,50.42 41.4,22.83 41.96,22.28 57.61,22.28 58.01,21.87 58.01,15.62 58.88,14.76 61.21,14.76 61.93,14.05 64.47,14.05 65.58,15.16 67.92,15.16 68.46,15.71 U12.5
PA6: length 23.6
  Top Layer w0.203: U7.31 10.22,51.43 H2.30
PA7: length 26.3
  Top Layer w0.203: H2.29 8.18,50.93 U7.32
PA8: length 48.3
  Top Layer w0.203: H3.30 73.27,51.96 72.44,51.13 66.55,51.13 66.04,50.62 66.04,38.48 64.36,36.8 42.67,36.81 41.98,37.5 U7.67
PA9: length 118.8
  Top Layer w0.203: U7.68 42.48,37.76 43.08,37.16 64.16,37.16 65.68,38.68 65.68,51.84 66.24,52.4 70.71,52.4 H3.29 ; U15.3 25.4,80.19 25.81,79.78 25.81,78.66 26.16,78.31 v1(33.99,78.31)
  Bottom Layer w0.203: H3.29 70.66,52.45 69.39,52.45 68.99,52.86 68.99,64.44 68.43,65 34.39,65 33.99,65.41 v1(33.99,78.31)
PA10: length 123
  Top Layer w0.203: H3.28 73.27,54.55 72.44,53.72 65.84,53.72 65.34,53.22 65.34,38.9 63.96,37.52 43.49,37.52 42.98,38.02 U7.69 ; U15.2 25.04,78.92 25.35,78.61 25.35,77.95 25.55,77.75 34.5,77.75 v1(34.55,77.71)
  Bottom Layer w0.203: H3.28 73.27,54.55 72.44,53.72 69.74,53.72 69.39,54.07 69.39,64.64 68.63,65.41 35,65.41 34.55,65.86 v1(34.55,77.71)
PA11: length 144.6
  Top Layer w0.203: USB2.A7 29.21,92.28 ; 29.21,92.28 30.02,92.28 30.23,92.48 30.23,93.38 USB2.B7 ; 29.21,92.28 29.21,90.91 29.36,90.76 29.78,90.76 29.92,90.62 29.92,90.5 29.78,90.36 29.36,90.36 29.21,90.21 29.21,90.1 29.36,89.95 29.78,89.95 29.92,89.81 29.92,89.69 29.78,89.55 29.36,89.55 29.21,89.4 29.21,89.28 29.36,89.14 29.78,89.14 29.92,89 29.92,88.88 29.78,88.73 29.36,88.73 29.21,88.59 29.21,88.47 29.36,88.33 29.78,88.33 29.92,88.18 29.92,88.06 29.78,87.92 29.36,87.92 29.21,87.78 29.21,87.45 29.67,87 v1(33.43,87) ; v1(45.11,52.4) 37.03,52.4 36.53,51.89 36.53,44.27 36.83,43.97 43.49,43.97 43.84,43.61 43.84,42.7 43.48,42.34 U7.70 43.48,38.33 43.89,37.92 63.75,37.92 65.03,39.2 65.03,54.34 65.63,54.94 70.71,54.94 H3.27
  Bottom Layer w0.203: v1(33.43,87) 33.43,64.85 33.78,64.49 49.28,64.49 49.99,63.78 49.99,52.86 49.53,52.4 v1(45.11,52.4)
PA12: length 144.6
  Top Layer w0.203: H3.26 73.27,57.09 72.39,56.21 65.23,56.21 64.73,55.71 64.73,39.41 63.6,38.28 44.4,38.28 43.98,38.7 U7.71 43.98,42.28 44.3,42.6 44.3,44.02 43.94,44.37 37.19,44.37 36.93,44.63 36.93,51.59 37.19,51.84 v1(44.2,51.84) ; v1(32.87,86.39) 29.26,86.39 28.7,86.94 28.7,89.17 R15.1 28.71,89.81 USB2.B6 28.71,94.37 28.96,94.61 29.57,94.61 29.72,94.46 29.72,93.4 USB2.A6
  Bottom Layer w0.203: v1(44.2,51.84) 44.2,52.65 44.5,52.96 49.22,52.96 49.58,53.31 49.58,63.53 49.02,64.08 33.32,64.08 32.87,64.54 v1(32.87,86.39)
PA13: length 126.6
  Top Layer w0.203: 57.25,38.63 63.4,38.63 64.41,39.65 64.41,56.82 65.05,57.46 H3.25 ; 57.25,38.63 57.25,38.64 v1(57.25,39.14) ; 57.25,38.63 44.86,38.63 44.48,39.01 U7.72 ; 22.05,15.98 50.7,15.98 51.97,17.25 56.95,17.25 57.25,17.55 v1(57.25,24.46)
  Bottom Layer w0.203: H4.2 10.56,24.31 11.02,23.86 11.02,16.61 11.53,16.1 21.84,16.1 21.87,16.08 21.94,16.08 v1(22.05,15.98) ; v1(57.25,24.46) v1(57.25,39.14)
PA14: length 125.5
  Top Layer w0.203: H3.24 73.27,59.78 72.34,58.85 65.84,58.85 64.11,57.12 64.11,43.21 62.83,41.93 57.1,41.93 ; 57.1,41.93 v1(57.1,41.48) ; 57.1,41.93 U7.76 ; v1(22.05,16.74) 50.85,16.74 51.76,17.65 55.98,17.65 56.49,18.16 v1(56.49,24.46)
  Bottom Layer w0.203: v1(22.05,16.74) 11.76,16.74 11.38,17.12 11.38,26.44 10.97,26.85 H4.3 ; v1(57.1,41.48) 56.49,40.87 v1(56.49,24.46)
PA15: length 92.8
  Top Layer w0.203: H3.23 70.6,59.87 66.29,59.87 63.75,57.33 63.75,43.71 62.47,42.43 U7.77 47.52,42.44 46.82,42.44 46.62,42.24 45.36,42.24 44.81,42.8 44.81,45.34 44.4,45.75 v1(38.96,45.75)
  Bottom Layer w0.203: v1(38.96,45.75) 38.86,45.64 38.86,43.05 38.2,42.39 32.11,42.39 31.85,42.14 31.85,9.7 U13.2
PB0: length 24.5
  Top Layer w0.203: H2.34 9.3,47.27 21.13,47.27 21.54,47.68 21.54,48.49 22.48,49.43 U7.35
PB1: length 28.4
  Top Layer w0.203: H2.33 7.93,46.1 21.54,46.1 21.95,46.51 21.95,48.18 22.69,48.93 U7.36
PB3: length 100.8
  Top Layer w0.203: v1(40.84,47.57) 41.76,47.57 42.61,48.43 U7.89 58.82,48.43 59.38,49 59.38,59.97 64.97,65.56 64.97,73.84 66.45,75.31 70.66,75.31 H3.11
  Bottom Layer w0.203: U13.3 29.25,28.01 29.57,28.32 30.63,28.32 31.44,29.13 31.44,42.39 31.8,42.75 37.9,42.75 38.41,43.26 38.41,47.12 38.86,47.57 v1(40.84,47.57)
PB4: length 107.5
  Top Layer w0.203: H3.10 71.97,76.48 66.4,76.48 66.09,76.17 66.09,75.51 64.57,73.99 64.57,65.86 59.03,60.33 59.03,49.56 58.4,48.93 U7.90 42.45,48.93 41.91,48.39 v1(40.84,48.39)
  Bottom Layer w0.203: v1(40.84,48.39) 38.41,48.39 38,47.98 38,43.56 37.54,43.1 31.5,43.1 31.04,42.65 31.04,29.44 30.33,28.73 27.23,28.73 26.75,28.25 U13.4
PB5: length 108.5
  Top Layer w0.203: v1(40.84,49.3) 40.85,49.31 46.34,49.31 46.48,49.45 47.51,49.45 U7.91 57.99,49.43 58.67,50.11 58.67,60.63 64.16,66.12 64.16,74.19 65.74,75.77 65.74,77.55 66.04,77.85 70.66,77.85 H3.9
  Bottom Layer w0.203: U13.5 24.25,28.75 24.69,29.19 30.07,29.19 30.68,29.79 30.68,42.9 31.24,43.46 37.24,43.46 37.59,43.81 37.59,48.79 38.1,49.3 v1(40.84,49.3)
PB6: length 77.2
  Top Layer w0.203: 46.8,28.67 v1(44.55,28.67) ; H3.8 72.01,79.06 65.62,79.06 65.33,78.77 65.33,75.87 63.75,74.3 63.75,66.32 58.27,60.83 58.27,50.52 57.68,49.93 U7.92 44.61,49.93 v1(44.55,49.87)
  Bottom Layer w0.203: v1(44.55,28.67) 44.55,28.67 v1(44.55,49.87)
PB7: length 78.7
  Top Layer w0.203: LED4.1 46.8,26.7 v1(43.99,26.7) ; v1(43.79,50.27) 43.95,50.43 U7.93 57.26,50.43 57.91,51.08 57.91,61.14 63.4,66.62 63.4,74.55 64.92,76.07 64.92,80.04 65.21,80.32 H3.7
  Bottom Layer w0.203: v1(43.79,50.27) 43.99,50.06 43.99,27.36 43.99,27.36 v1(43.99,26.7)
PB8: length 51.7
  Top Layer w0.203: U7.95 56.84,51.43 57.56,52.15 57.56,61.39 62.99,66.83 62.99,74.65 64.52,76.17 64.52,81.25 64.87,81.61 72.02,81.61 H3.6
PB9: length 49.4
  Top Layer w0.203: U7.96 56.58,51.93 57.15,52.5 57.15,61.54 62.64,67.03 62.64,74.83 64.11,76.3 64.11,82.37 64.57,82.83 70.7,82.83 H3.5
PB10: length 131.3
  Top Layer w0.203: 60.73,5 72.03,5 72.64,5.61 R21.1 ; 60.73,5 9.86,5 9.3,5.56 v1(9.3,29.59) ; 60.73,5 60.75,5.03 P1.2 ; U7.47 27.15,43.43 26.57,42.85 26.57,32.94 25.68,32.06 H2.46
  Bottom Layer w0.203: v1(9.3,29.59) 9.3,32.03 H2.46
PB11: length 132.4
  Top Layer w0.203: H2.45 6.73,32.06 7.78,31.01 8.69,31.01 ; 8.69,31.01 8.69,5.51 9.75,4.45 10.04,4.45 10.05,4.45 63.29,4.45 v1(63.3,4.45) ; 8.69,31.01 13.51,31.01 13.99,31.49 25.93,31.49 26.97,32.54 26.97,42.39 27.51,42.93 U7.48 ; R22.1 70.87,6.22 70.46,5.82 v1(63.25,5.82) P1.3
  Bottom Layer w0.203: v1(63.3,4.45) 63.3,5.77 v1(63.25,5.82)
PB12: length 109.3
  Top Layer w0.203: H3.46 72.02,30.81 67.26,30.81 67.06,31.01 35.76,31.01 33.98,32.8 U7.51
  Bottom Layer w0.203: U14.5 48.25,6.94 48.72,6.48 76.91,6.48 77.62,7.19 77.62,29.9 76.96,30.56 73.66,30.56 73.27,30.95 H3.46
PB13: length 104.2
  Top Layer w0.203: U7.52 34.48,33.11 36.17,31.42 69.99,31.42 70.63,32.06 H3.45
  Bottom Layer w0.203: U14.4 50.75,7.24 51.05,6.93 76.71,6.93 77.22,7.44 77.22,29.64 76.71,30.15 71.12,30.15 70.71,30.56 70.71,32.04 H3.45
PB14: length 94
  Top Layer w0.203: v1(53.24,15.57) 53.24,15.82 53.39,15.98 58.12,15.98 58.62,16.49 58.62,29.84 59.13,30.35 74.02,30.35 74.73,31.06 74.73,34.11 74.24,34.6 H3.44 73.27,33.98 72.64,33.35 68.53,33.35 67,31.83 36.58,31.83 34.98,33.42 U7.53
  Bottom Layer w0.203: U14.3 53.25,13.32 R20.1 53.24,13.44 v1(53.24,15.57)
PB15: length 92.3
  Top Layer w0.203: v1(55.76,15.42) 58.37,15.42 59.03,16.08 59.03,29.59 59.38,29.95 74.17,29.95 75.13,30.91 75.13,34.92 74.4,35.65 71.78,35.65 H3.43 70.71,34.62 69.29,34.62 66.85,32.18 36.98,32.18 35.48,33.69 U7.54
  Bottom Layer w0.203: v1(55.76,15.42) R19.1 55.75,13.37 U14.2
PC0: length 41.5
  Top Layer w0.203: v1(39.34,54.03) 38.98,54.39 U7.15
  Bottom Layer w0.203: v1(39.34,54.03) 39.3,54.03 38.03,55.3 12.55,55.3 12.19,55.65 12.19,64.59 11.79,65 9.35,65 H2.20
PC1: length 42.5
  Top Layer w0.203: U7.16 38.51,55.45 v1(38.51,54.03)
  Bottom Layer w0.203: v1(38.51,54.03) 37.59,54.94 12.24,54.94 11.79,55.4 11.79,63.32 11.33,63.78 8.03,63.78 H2.19
PC2: length 37.5
  Top Layer w0.203: v1(37.67,54.03) 37.98,54.34 U7.17
  Bottom Layer w0.203: v1(37.67,54.03) 37.11,54.58 11.99,54.58 11.43,55.14 11.43,61.95 11.02,62.36 9.45,62.36 H2.22
PC3: length 38.9
  Top Layer w0.203: U7.18 37.48,54.63 36.88,54.03 v1(36.83,54.03)
  Bottom Layer w0.203: H2.21 7.98,61.29 10.52,61.29 10.97,60.83 10.97,54.89 11.84,54.03 v1(36.83,54.03)
PC4: length 23.4
  Top Layer w0.203: U7.33 21.7,50.43 21.11,49.84 H2.32
PC5: length 26.7
  Top Layer w0.203: H2.31 7.88,48.69 20.98,48.69 22.22,49.93 U7.34
PC6: length 47.7
  Top Layer w0.203: U7.63 39.98,36.25 40.84,35.38 65.18,35.38 67.46,37.67 67.46,45.69 67.77,46 72.44,46 73.27,46.83 H3.34
PC7: length 44.5
  Top Layer w0.203: H3.33 70.71,47.32 67.56,47.32 67.11,46.86 67.11,37.87 64.97,35.74 41.3,35.74 40.48,36.56 U7.64
PC8: length 47.9
  Top Layer w0.203: H3.32 73.27,49.32 72.44,48.49 67.21,48.49 66.75,48.03 66.75,38.08 64.77,36.09 41.86,36.09 40.98,36.97 U7.65
PC9: length 44.8
  Top Layer w0.203: U7.66 41.48,37.23 42.27,36.45 64.57,36.45 66.4,38.28 66.4,49.4 66.85,49.86 70.71,49.86 H3.31
PC10: length 131.2
  Top Layer w0.203: R25.1 50.55,11.91 49.63,12.83 39.62,12.83 38.75,11.95 P3.2 38.75,6.23 39.32,5.66 51.31,5.66 52.02,6.38 52.02,16.03 52.38,16.38 57.81,16.38 58.22,16.79 58.22,25.32 57.76,25.78 v1(53.9,25.78) ; H3.22 73.27,62.17 72.49,61.39 67.26,61.39 63.4,57.53 63.4,44.02 62.31,42.93 U7.78 46.24,42.93 v1(46.18,42.87)
  Bottom Layer w0.203: v1(46.18,42.87) 45.72,42.41 45.72,30.25 46.18,29.79 53.54,29.79 53.9,29.44 v1(53.9,25.78)
PC11: length 120.9
  Top Layer w0.203: v1(53.29,25.22) 57.51,25.22 57.81,24.92 57.81,17.15 57.51,16.84 52.17,16.84 51.61,16.28 51.61,6.63 51.05,6.07 41.71,6.07 41.25,6.53 P3.3 41.25,11.61 41.81,12.17 48.26,12.17 48.77,11.66 R26.1 ; H3.21 67.85,62.54 63.04,57.73 63.04,44.37 62.1,43.43 U7.79 46.11,43.43 v1(45.77,43.76)
  Bottom Layer w0.203: v1(53.29,25.22) 53.29,29.18 53.03,29.44 45.82,29.44 45.26,30 45.26,43.26 v1(45.77,43.76)
PC12: length 42.4
  Top Layer w0.203: U7.80 61.89,43.93 62.69,44.73 62.69,57.94 68.58,63.83 72.34,63.83 73.27,64.76 H3.20
PC13: length 49.2
  Top Layer w0.203: v1(42.06,53.77) 42.98,54.69 U7.7
  Bottom Layer w0.203: v1(42.06,53.77) 42.06,54.18 41.66,54.58 39.27,54.58 38.2,55.65 13,55.65 12.65,56.01 12.65,65.96 12.24,66.37 8.13,66.37 6.88,67.62 H2.17
PD0: length 39.3
  Top Layer w0.203: U7.81 61.52,44.43 62.33,45.24 62.33,58.19 69.22,65.08 H3.19
PD1: length 42.7
  Top Layer w0.203: H3.18 73.27,67.35 72.34,66.42 70,66.42 61.98,58.39 61.98,45.69 61.21,44.93 U7.82
PD2: length 41.4
  Top Layer w0.203: H3.17 67.75,67.62 67.36,67.23 67.36,64.34 61.57,58.55 61.57,46.05 60.95,45.43 U7.83
PD3: length 45.3
  Top Layer w0.203: H3.16 72.02,68.91 67.31,68.91 66.95,68.56 66.95,64.49 61.21,58.75 61.21,46.56 60.59,45.93 U7.84
PD4: length 43.1
  Top Layer w0.203: U7.85 60.27,46.43 60.81,46.97 60.81,58.9 66.55,64.64 66.55,69.88 66.83,70.16 H3.15
PD5: length 47.2
  Top Layer w0.203: H3.14 73.27,72.33 72.49,71.55 66.45,71.55 66.14,71.25 66.14,64.85 60.45,59.16 60.45,47.52 59.86,46.93 U7.86
PD6: length 44.6
  Top Layer w0.203: H3.13 66.07,72.7 65.74,72.36 65.74,65.05 60.1,59.42 60.1,48.04 59.49,47.43 U7.87
PD7: length 48.4
  Top Layer w0.203: H3.12 71.97,73.94 65.74,73.94 65.38,73.58 65.38,65.35 59.74,59.72 59.74,48.54 59.13,47.93 U7.88
PD8: length 78.3
  Top Layer w0.203: v1(43.28,43.1) 36.37,43.1 35.98,42.71 U7.55 35.98,33.95 37.39,32.54 66.6,32.54 70.1,36.04 72.85,36.04 73.27,36.47 H3.42 ; LED5.1 43.32,24.73 v1(43.28,24.76)
  Bottom Layer w0.203: v1(43.28,24.76) v1(43.28,43.1)
PD9: length 42.7
  Top Layer w0.203: U7.56 36.48,34.26 37.85,32.89 66.45,32.89 70.69,37.14 H3.41
PD10: length 46.5
  Top Layer w0.203: U7.57 36.98,34.57 38.3,33.25 66.24,33.25 69.63,36.64 69.63,38.18 69.83,38.38 72.54,38.38 73.27,39.11 H3.40
PD11: length 43.3
  Top Layer w0.203: U7.58 37.48,34.83 38.71,33.6 66.09,33.6 69.24,36.75 69.24,39.31 69.53,39.6 70.65,39.6 H3.39
PD12: length 47
  Top Layer w0.203: U7.59 37.98,35.1 39.12,33.96 65.94,33.96 68.88,36.91 68.88,40.72 69.14,40.97 72.54,40.97 73.27,41.7 H3.38
PD13: length 43.8
  Top Layer w0.203: U7.60 38.48,35.41 39.57,34.32 65.79,34.32 68.53,37.06 68.53,41.94 68.78,42.19 70.7,42.19 H3.37
PD14: length 47.4
  Top Layer w0.203: U7.61 38.98,35.62 39.93,34.67 65.58,34.67 68.17,37.26 68.17,43.36 68.38,43.56 72.49,43.56 73.27,44.34 H3.36
PD15: length 44.1
  Top Layer w0.203: U7.62 39.48,35.98 40.44,35.03 65.38,35.03 67.82,37.47 67.82,44.32 68.28,44.78 70.71,44.78 H3.35
PE0: length 53.5
  Top Layer w0.203: H3.4 72.07,84.2 64.06,84.2 63.65,83.8 63.65,76.33 62.23,74.91 62.23,67.28 56.74,61.8 56.74,52.81 56.37,52.43 U7.97
PE1: length 51.2
  Top Layer w0.203: H3.3 70.71,85.42 63.7,85.42 63.19,84.91 63.19,76.48 61.82,75.11 61.82,67.49 56.34,62 56.34,53.26 56,52.93 U7.98
PE2: length 56
  Top Layer w0.203: U7.1 45.98,54.27 46.19,54.06 v1(46.19,53.77)
  Bottom Layer w0.203: v1(46.19,53.77) 46.19,55.43 45.47,56.16 39.98,56.16 38.71,57.43 15.04,57.43 14.73,57.73 14.73,72.11 14.22,72.62 9.35,72.62 H2.14
PE3: length 57
  Top Layer w0.203: v1(45.38,53.77) 45.48,53.87 U7.2
  Bottom Layer w0.203: v1(45.38,53.77) 45.38,55.33 44.86,55.86 39.83,55.86 38.61,57.07 14.68,57.07 14.33,57.43 14.33,70.89 13.82,71.4 8.03,71.4 H2.13
PE4: length 51.9
  Top Layer w0.203: v1(44.55,53.77) 44.98,54.2 U7.3
  Bottom Layer w0.203: H2.16 9.5,69.93 13.36,69.93 13.92,69.37 13.92,57.07 14.28,56.72 38.51,56.72 39.68,55.55 43.99,55.55 44.55,54.99 v1(44.55,53.77)
PE5: length 53.2
  Top Layer w0.203: U7.4 44.48,54.51 43.74,53.77 v1(43.72,53.77)
  Bottom Layer w0.203: v1(43.72,53.77) 43.72,54.86 43.33,55.25 39.52,55.25 38.41,56.36 13.87,56.36 13.51,56.72 13.51,68.3 12.9,68.91 7.98,68.91 H2.15
PE6: length 48.4
  Top Layer w0.203: v1(42.89,53.77) 43.55,54.43 43.65,54.43 43.98,54.76 U7.5
  Bottom Layer w0.203: H2.18 9.4,67.49 12.65,67.49 13.06,67.08 13.06,56.36 13.41,56.01 38.3,56.01 39.37,54.94 42.57,54.94 42.89,54.62 v1(42.89,53.77)
PE7: length 30.2
  Top Layer w0.203: U7.38 23.27,47.93 22.81,47.47 22.81,43.87 22.45,43.51 7.98,43.51 H2.35
PE8: length 27.9
  Top Layer w0.203: U7.39 23.78,47.43 23.22,46.86 23.22,42.6 22.77,42.15 9.34,42.15 H2.38
PE9: length 31.5
  Top Layer w0.203: U7.40 24.3,46.93 23.62,46.25 23.62,41.43 23.16,40.97 7.98,40.97 H2.37
PE10: length 29.3
  Top Layer w0.203: H2.40 9.3,39.65 23.57,39.65 24.03,40.11 24.03,45.75 24.71,46.43 U7.41
PE11: length 33
  Top Layer w0.203: H2.39 7.98,38.43 23.98,38.43 24.44,38.89 24.44,45.19 25.18,45.93 U7.42
PE12: length 30.8
  Top Layer w0.203: U7.43 25.49,45.43 24.84,44.78 24.84,37.57 24.38,37.11 9.3,37.11 H2.42
PE13: length 64.6
  Top Layer w0.203: 18.59,18.81 SW2.1 v1(13.11,18.81) ; 18.59,18.81 18.59,20.97 C25.2 ; 18.59,18.81 23.81,18.81 ; U7.44 25.8,44.93 25.25,44.37 25.25,36.5 24.84,36.09 v1(13.11,36.09) 9.71,36.09 9.71,36.09 8.83,36.09 8.83,36.09 7.78,36.09 H2.41
  Bottom Layer w0.203: v1(13.11,18.81) v1(13.11,36.09)
PE14: length 69
  Top Layer w0.203: H2.44 9.35,34.52 v1(19.25,34.52) 25.15,34.52 25.65,35.03 25.65,43.76 26.32,44.43 U7.45 ; v1(19.25,22.28) 24.18,22.28 24.69,21.77 24.69,20.19 26.07,18.81 SW3.1 33.76,18.81 ; 33.76,18.81 C26.2 ; 33.76,18.81 SW3.2
  Bottom Layer w0.203: v1(19.25,22.28) v1(19.25,34.52)
PE15: length 97.5
  Top Layer w0.203: 48.96,18.81 54.21,18.81 ; 48.96,18.81 48.96,21.01 ; 48.96,18.81 SW4.1 45.11,17.7 44.7,17.3 v1(12.29,17.3) ; H2.43 6.73,34.49 7.92,33.3 12.3,33.3 ; 12.3,33.3 12.29,33.3 v1(12.29,33.25) ; 12.3,33.3 25.45,33.3 26.11,33.96 26.11,43.26 26.78,43.93 U7.46
  Bottom Layer w0.203: v1(12.29,17.3) v1(12.29,33.25)
RST: length 142.7
  Top Layer w0.203: v1(31.9,84.86) 33.96,84.86 33.99,84.89 ; 18.47,28.03 23.81,28.03 ; 18.47,28.03 SW1.1 ; 18.47,28.03 18.48,28.04 C24.2 R10.1 20.31,30.77 ; SW1.2 23.83,28.02 25.35,28.02 25.76,28.42 v1(25.76,29.84) ; U7.14 39.48,54.73 v1(40.18,54.03) ; v1(5.69,71.45) 5.68,71.44 5.68,53.68 v1(5.69,53.67)
  Bottom Layer w0.203: v1(5.69,53.67) 10.16,53.67 11.58,52.25 32.51,52.25 ; v1(31.9,84.86) 31.9,74.3 31.55,73.94 6.1,73.94 5.68,73.52 5.68,71.46 v1(5.69,71.45) ; 32.51,52.25 34.75,52.25 35.71,53.21 39.98,53.21 40.18,53.42 v1(40.18,54.03) ; 32.51,52.25 32.51,44.07 32.26,43.81 30.94,43.81 30.28,43.16 30.28,30.25 29.87,29.84 v1(25.76,29.84)
RTS: length 23.3
  Top Layer w0.203: R30.1 34.8,83.54 34.54,83.8 28.75,83.8 28.43,83.47 Q1.2 29.22,82.92 29.51,82.63 v1(29.51,80.19) ; U15.14 v1(19.3,80.19)
  Bottom Layer w0.203: v1(19.3,80.19) v1(29.51,80.19)
USB+5V: length 75
  Top Layer w0.254: LED2.2 78.79,92.82 v1(78.79,92.38)
  Top Layer w0.381: v1(62.08,79.22) R3.2
  Bottom Layer w0.254: v1(78.79,92.38) 64.57,92.38 63.86,93.09 63.86,95.38 63.25,95.99 51.36,95.99 50.75,95.38 50.75,91.42 50.09,90.75 v1(48.56,90.75)
  Bottom Layer w0.381: v1(62.08,79.22) 62.08,83.29 61.16,84.2 41.1,84.2 39.17,82.27 v1(39.17,74.45)
  vias: v1(11.05,91.96) v1(11.05,91.14) v1(15.85,91.96) v1(15.85,91.14) v1(27.06,92.03) v1(27.06,91.21) v1(31.86,92.03) v1(31.86,91.21) v1(32.59,92.03) v1(32.59,91.21) v1(33.32,92.03) v1(33.32,91.21)
$1N1478: length 17.1
  Top Layer w0.254: v1(57.62,64.12) 60.64,67.15 v1(60.69,67.15)
  Bottom Layer w0.254: D1.2 58.91,59.35 57.62,60.64 v1(57.62,64.12) ; v1(60.69,67.15) 64.99,67.15 65.63,67.79 65.63,69.51 BT1.1
$1N1482: length 17.5
  Top Layer w0.254: v1(50.9,56.16) 50.85,56.11 46.89,56.11 46.28,56.72 43.84,56.72 43.48,56.36 U7.6
  Bottom Layer w0.254: D1.3 56.31,59.17 C18.1 54.01,59.17 53.59,58.75 53.59,56.62 53.14,56.16 v1(50.9,56.16)
$1N1974: length 11.4
  Top Layer w0.254: U7.21 35.98,56.87 35.14,57.71 30,57.71 29.72,57.99 C19.2
$1N3287: length 10.5
  Top Layer w0.203: H1.3 33.05,26.49 31.39,26.49 30.89,25.98 30.89,21.46 30.53,21.11 R11.2
$1N3292: length 10.4
  Top Layer w0.203: H1.4 37.59,26.59 38.1,26.09 38.1,21.72 38.71,21.11 41.3,21.11
$2N1532: length 2.9
  Top Layer w0.381: C4.1 60.45,78.25 60.45,78.87 60.12,79.2 U2.1
$2N2883: length 1.8
  Top Layer w0.254: R5.2 77.25,91.11 LED1.1
$2N2994: length 1.8
  Top Layer w0.254: R6.2 77.25,92.89 LED2.1
$3N1280: length 2.2
  Top Layer w0.203: R18.2 50.57,24.73 48.4,24.73
$3N1284: length 2.2
  Top Layer w0.203: LED4.2 50.57,26.7 R17.2
$3N1289: length 2.2
  Top Layer w0.203: R16.2 50.57,28.67 LED3.2
$3N3983: length 8.8
  Top Layer w0.203: U16.1 30.58,84.95 30.58,85.78 30.38,85.98 27.01,85.98 26.81,85.78 R27.1 26.43,84.51 Q1.3
$3N4018: length 1.8
  Top Layer w0.203: R28.2 28.43,79.42 Q1.1
$3N4022: length 2
  Top Layer w0.203: Q2.1 34.6,81.02 R30.2
$3N4028: length 4.1
  Top Layer w0.203: Q2.3 30.88,80.5 31.14,80.24 32.36,80.24 32.63,79.97 R29.2

## Copper pours and planes (outline as drawn; the poured copper is in the pictures)
AGND on Top Layer: 19.71,61.9 21.84,61.9 21.84,60.63 19.71,60.63
AGND on Top Layer: 28.88,63.73 37.13,63.73 37.13,54.64 28.88,54.64
AGND on Top Layer: 26.26,66.32 30.56,66.32 30.56,61.65 26.26,61.65
AGND on Top Layer: 59.54,29.13 76.86,29.13 76.86,11.96 59.54,11.96
AGND on Bottom Layer: 19.71,66.32 30.56,66.32 30.56,60.66 19.71,60.66
AGND on Bottom Layer: 59.64,29.08 76.86,29.08 76.86,11.96 59.64,11.96
GND on Top Layer: -2.13,102.13 81.74,102.13 81.74,-2.31 -2.13,-2.31
GND on Top Layer: 37.54,61.14 41.32,61.14 41.32,59.46 37.54,59.46
GND on Top Layer: 33.01,63.53 36.78,63.53 36.78,61.59 33.01,61.59
GND on Bottom Layer: -2.13,102.13 81.38,102.13 81.38,-1.5 -2.13,-1.5
VCC+3.3V on Top Layer: 8.08,89.21 10.54,89.21 10.54,79.22 8.08,79.22
VCC+3.3V on Top Layer: 22.2,76.89 29.46,76.89 29.46,66.32 22.2,66.32
VCC+3.3V on Top Layer: 31.88,30.4 36.96,30.4 36.96,27.86 31.88,27.86
VCC+5V on Top Layer: 5.46,89.21 7.92,89.21 7.92,79.22 5.46,79.22
VCC+5V on Top Layer: 28.75,88.06 37.95,88.06 37.95,68.25 28.75,68.25
VCC+5V on Bottom Layer: 35.74,86.25 37.9,86.25 37.9,83.49 35.74,83.49
VCCA+3.3V on Top Layer: 19.71,66.12 23.62,66.12 23.62,62.05 19.71,62.05
USB+5V on Top Layer: 15.01,94.03 16.69,94.03 16.69,90.58 15.01,90.58
USB+5V on Top Layer: 10.21,94.04 11.89,94.04 11.89,90.6 10.21,90.6
USB+5V on Top Layer: 31.01,96.39 49.89,96.39 49.89,90.6 31.01,90.6
USB+5V on Top Layer: 38.51,94.26 57.96,94.26 57.96,64.85 38.51,64.85
USB+5V on Top Layer: 31.01,94.04 32.69,94.04 32.69,90.6 31.01,90.6
USB+5V on Top Layer: 26.21,94.06 27.89,94.06 27.89,90.62 26.21,90.62
USB+5V on Bottom Layer: 10.21,92.49 33.99,92.49 33.99,90.6 10.21,90.6
$1N1974 on Top Layer: 22.1,63.47 30.33,63.47 30.33,60.68 22.1,60.68
$2N821 on Top Layer: 48.56,97.82 68.58,97.82 68.58,83.19 48.56,83.19
$2N1087 on Top Layer: 40.39,86.28 54.05,86.28 54.05,78.92 40.39,78.92
$2N1523 on Top Layer: 51.76,79.63 60.96,79.63 60.96,71.56 51.76,71.56
$2N6141 on Top Layer: 35.66,94.31 46.94,94.31 46.94,88.72 35.66,88.72

Small or netless copper shapes (teardrops, artwork), in the pictures only: 622 on Top Layer, 150 on Bottom Layer

## Text on the board
Bottom Silkscreen Layer: 5V | 3V3 | JLCJLCJLCJLC | SPI:PA15(CS)PB3(CLK)PB4(MOSI)PB5(MISO) | IIC:PB15(SCL)PB14(SDA)PB13PB12 | SPI | IIC | DAC: | PA4 PA5 | ADC: | PA0 PA1 | USART2:PA2(TX)PA3(RX) | USART3:PB10(TX)PB11(RX) | USART4:PC10(TX)PC11(RX) | 引脚分配
Top Silkscreen Layer: BOOT0 | BOOT1 | PC13 | PE13 | PE15 | PB11 | PE11 | PA3 | PA5 | PA7 | PC3 | PC5 | GND | PE3 | PE5 | PE7 | CLK | PE9 | PA1 | PC1 | PB1 | DIO | 5V | PB10 | PE14 | PE10 | PE12 | 3V3 | PA4 | PA0 | PA2 | PC4 | PC0 | PC2 | PA6 | PB0 | PB2 | PE4 | PE2 | PE8 | PE6 | PA15 | PA13 | PB15 | PB13 | PD15 | PD13 | PA11 | PD11 | PC11 | PA9 | PC9 | PC7 | PD9 | PD4 | PB7 | PB5 | PB3 | PD2 | PD0 | PB9 | PD6 | PE1 | PA14 | PA12 | PA10 | PC12 | PC10 | PD14 | PB12 | PD10 | PB14 | PD12 | PA8 | PB4 | PC8 | PB8 | PD7 | PD5 | PD3 | PC6 | PD8 | PE0 | PB6 | PD1 | SWD | + | - | USART | USB | USART2 | USART4 | USART3 | RST | ADC | DAC
